# Altium schematic sheet Sheet1.SchDoc
size A4; SheetNumber: 1; SheetTotal: 1
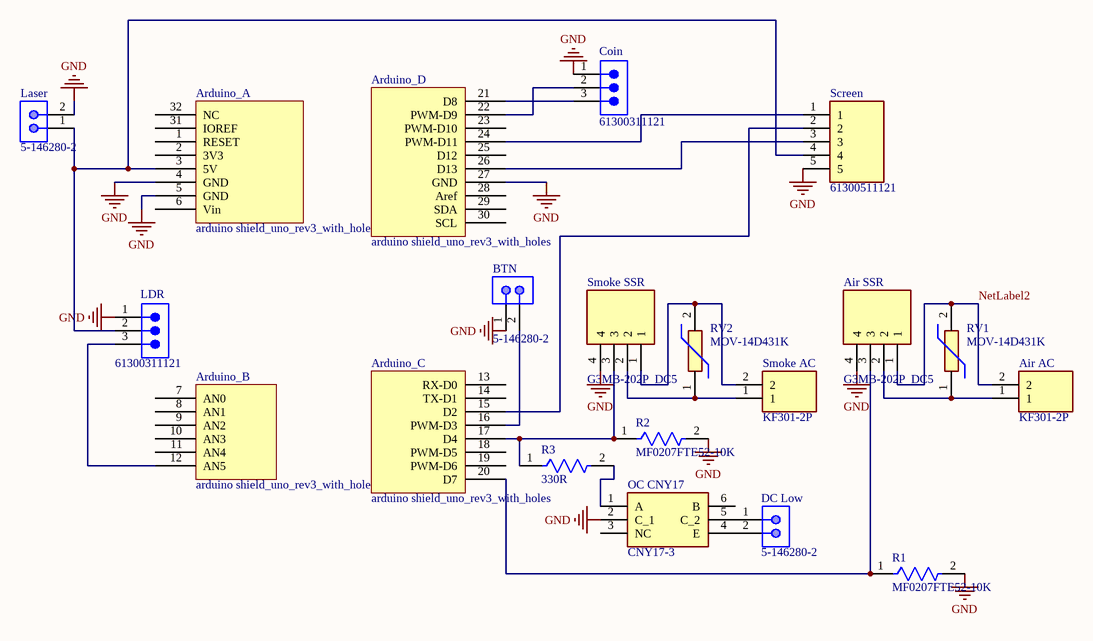
[diagram p0: Sheet1.SchDoc]

## Parts
Air_AC  KF301-2P  [KF3012P]
Air_SSR  G3MB-202P_DC5  [G3MC-201PL]
Arduino_  arduino shield_uno_rev3_with_holes  [ARDUINO UNO SHIELD WITH 3D MODEL]  (parts A,B,C,D of 4)
BTN  5-146280-2  [TECO-5-146280-2_V]
Coin  61300311121  [61300311121]
DC_Low  5-146280-2  [TECO-5-146280-2_V]
Laser  5-146280-2  [TECO-5-146280-2_V]
LDR  61300311121  [61300311121]
OC_CNY17  CNY17-3  [DIP762W60P254L730H430Q6N]
R1  MF0207FTE52-10K  [FP-MF0207-MFG]
R2  MF0207FTE52-10K  [FP-MF0207-MFG]
R3  330R  [FP-MF0207-MFG]
RV1  MOV-14D431K  [MOV-14D(5.2MM-T)]
RV2  MOV-14D431K  [MOV-14D(5.2MM-T)]
Screen  61300511121  [HDRV5W64P0X254_1X5_1270X254X854P]
Smoke_AC  KF301-2P  [KF3012P]
Smoke_SSR  G3MB-202P_DC5  [G3MC-201PL]

## Nets
GND: Air_SSR.4 Arduino_.4(GND) Arduino_.5(GND) Arduino_.27(GND) BTN.1 Coin.1 Laser.2 LDR.1 OC_CNY17.2(C_1) R1.2 R2.2 Screen.5 Smoke_SSR.4
NetLabel2: Air_AC.2 Air_SSR.1 RV1.2
NetAir_AC_1: Air_AC.1 Air_SSR.2 RV1.1
NetAir_SSR_3: Air_SSR.3 Arduino_.20(D7) R1.1
NetArduino__3: Arduino_.3(5V) Laser.1 LDR.2 Screen.4
NetArduino__12: Arduino_.12(AN5) LDR.3
NetArduino__15: Arduino_.15(D2) Screen.2
NetArduino__16: Arduino_.16(PWM-D3) BTN.2
NetArduino__17: Arduino_.17(D4) R2.1 R3.1 Smoke_SSR.3
NetArduino__21: Arduino_.21(D8) Coin.3
NetArduino__22: Arduino_.22(PWM-D9) Coin.2
NetArduino__24: Arduino_.24(PWM-D11) Screen.1
NetArduino__26: Arduino_.26(D13) Screen.3
NetDC_Low_1: DC_Low.1 OC_CNY17.5(C_2)
NetDC_Low_2: DC_Low.2 OC_CNY17.4(E)
NetOC_CNY17_1: OC_CNY17.1(A) R3.2
NetRV2_1: RV2.1 Smoke_AC.1 Smoke_SSR.2
NetRV2_2: RV2.2 Smoke_AC.2 Smoke_SSR.1

Not connected (* = marked no-connect by the designer): Arduino_ 1(RESET) 2(3V3) 6(Vin) 7(AN0) 8(AN1) 9(AN2) 10(AN3) 11(AN4) 13(RX-D0) 14(TX-D1) 18(PWM-D5) 19(PWM-D6) 23(PWM-D10) 25(D12) 28(Aref) 29(SDA) 30(SCL) 31(IOREF) 32(NC); OC_CNY17 3(NC) 6(B)

## Library data of the parts
Air_AC Smoke_AC = KF301-2P: Connector; Manufacturer_Name: Handson Technology; Datasheet Link: http://www.handsontec.com/dataspecs/terminal%20block-5mm.pdf; Height: 10mm; Manufacturer_Part_Number: KF301-2P
Air_SSR Smoke_SSR = G3MB-202P_DC5: Relay or Contactor; Manufacturer_Name: OMRON Electronics; Manufacturer_Part_Number: G3MB-202P DC5; Datasheet Link: http://www.mouser.com/ds/2/307/g3mb_0609-298620.pdf; Mouser Part Number: 653-G3MB-202P-DC5; Mouser Price/Stock: https://www.mouser.co.uk/ProductDetail/Omron-Automation-and-Safety/G3MB-202P-DC5?qs=lK7M36XCk6I5q71jdbaHVQ%3D%3D
BTN DC_Low Laser = CMP-2000-07492-1: Male Header, Pitch 2.54 mm, 1 x 2 Position, Height 8.21 mm, Tail Length 3.05 mm, -65 to 105 degC, RoHS, Bulk; Manufacturer: TE Connectivity; Mating Connector Lock: No(Without); Number of Positions: 2; Pitch: 2.54mm; PCB Mounting Orientation: Vertical; Keyed: No; Case\/Package: 100; Mating Post Length: 0.23inch; High Temperature Housing: Yes; Max Current Rating: 5A; PCB Thickness: 0.063inch; PCB Mount Retention: Without; Approvals: CSA; Current Rating: 3A; Radiation Hardening: No; Length: 4.67mm; Contact Mating Length: 0.23inch; Connector Type: Header; Number of Rows: 1; Termination Post Length: 0.12inch; Board Standoff: No(Without); Max Operating Temperature: 105degC; Contact Shape: Square; Selectively Loaded: No(Without); Gasket: No(Without); Number of Contacts: 2; Contact Gender: Male; Mating Alignment: No(Without); Manufacturer URL: http://www.te.com/; Datasheet URL: http://www.te.com/commerce/DocumentDelivery/DDEController?Action=showdoc&DocId=Customer+Drawing%7F146280%7FH1%7Fpdf%7FEnglish%7FENG_CD_146280_H1.pdf%7F5-146280-2; Mount: ThroughHole; Orientation: Straight; Packaging: Carton; Package Reference: 5-146280-2; Package Quantity: 500; Stabilizers: No(Without); Row Spacing: 2.54mm; Contact Material: CopperAlloy; Panel Mount Retention: No(Without); Datasheet Version: Rev. H1, 08/2016; Housing Colour: Black; Colour: Black; Package Description: Male Header, Pitch 2.54 mm, 1 x 2 Position, Height 8.21 mm, Tail Length 3.05 mm; Contact Plating: Matte; Housing Material: Polymer; Contact Protection: No(Without); Min Operating Temperature: -65degC; Mounting Technology: ThroughHole; Flammability Rating: UL94V-0; RoHSCompliant: true; Termination: ThroughHole; Depth: 2.34mm; High Speed Serial Data Connector: No
Coin LDR = CMP-1502-01062-3: NexarPartId: 32855521; Current Rating: 3A; Voltage Rating: 250V; Number of Positions: 3; Pitch: 2.54mm; Contact Resistance: 20mΩ; Connector Type: Male Pin; Gender: Male; REACH SVHC: Unknown; Packaging: Bulk; Contact Material: Copper; Min Operating Temperature: -40°C; Number of Rows: 1; Orientation: Vertical; RoHS: Compliant; Contact Plating: Gold; Max Operating Temperature: 105°C; Mount: Through Hole; Height: 8.94mm; Operating Supply Voltage: 250V; Number of Pins: 3; Contact Mating Length: 5.9944mm; Number of Contacts: 3; Color: Black; Lead Free: Lead Free; Lead Pitch: 2.54mm; Termination: Solder
OC_CNY17 = CNY17-3: Transistor; Manufacturer_Name: Vishay; Datasheet Link: https://www.vishay.com/docs/83606/cny17.pdf; Height: 4.3mm; Manufacturer_Part_Number: CNY17-3; Mouser Part Number: 782-CNY17-3; Mouser Price/Stock: https://www.mouser.co.uk/ProductDetail/Vishay-Semiconductors/CNY17-3?qs=BAbuF51x%252B%252BZgvdu84VHn%252Bw%3D%3D; Arrow Part Number: CNY17-3; Arrow Price/Stock: https://www.arrow.com/en/products/cny17-3/vishay?region=europe
R1 R2 = CMP-03413-000006-1: RES 10K OHM 1% 0.6W AXIAL; Temperature Coefficient: 50ppm/°C; Resistance: 10kR; Mount: Through Hole; Radiation Hardening: No; Tolerance: 1%; Construction: Cylindrical; Contact Plating: Tin; Case/Package: Conformal; Resistor Type: Metal Film; Min Operating Temperature: -55°C; Military Standard: Not; Lead Free: Lead Free; Diameter: 2.4mm; Termination: Axial; Max Operating Temperature: 155°C; RoHS Compliant: Yes; Packaging: Ammo Pack; Length: 6.3mm
R3 = CMP-03413-000006-1: RES 330 OHM AXIAL; Tolerance: 1%; Temperature Coefficient: 50ppm/°C; Resistance: 10kR; Mount: Through Hole; Radiation Hardening: No; Construction: Cylindrical; Contact Plating: Tin; Case/Package: Conformal; Resistor Type: Metal Film; Min Operating Temperature: -55°C; Military Standard: Not; Lead Free: Lead Free; Diameter: 2.4mm; Termination: Axial; Max Operating Temperature: 155°C; RoHS Compliant: Yes; Packaging: Ammo Pack; Length: 6.3mm
RV1 RV2 = MOV-14D431K: Varistor; Manufacturer_Name: Bourns; Datasheet Link: https://componentsearchengine.com/Datasheets/1/MOV-14D431K.pdf; Manufacturer_Part_Number: MOV-14D431K; Mouser Part Number: 652-MOV-14D431K; Mouser Price/Stock: https://www.mouser.co.uk/ProductDetail/Bourns/MOV-14D431K?qs=CQ3B1E%252BbPs0oqNHNiUHWVg%3D%3D; Arrow Part Number: MOV-14D431K; Arrow Price/Stock: https://www.arrow.com/en/products/mov-14d431k/bourns?utm_currency=USD&region=nac
Screen = 61300511121: Connector; Manufacturer_Name: Wurth Elektronik; Datasheet Link: https://www.we-online.com/catalog/datasheet/61300511121.pdf; Height: 8.54mm; Manufacturer_Part_Number: 61300511121; Mouser Part Number: 710-61300511121; Mouser Price/Stock: https://www.mouser.co.uk/ProductDetail/Wurth-Elektronik/61300511121?qs=PhR8RmCirEZCsCRHq%252BvfRQ%3D%3D